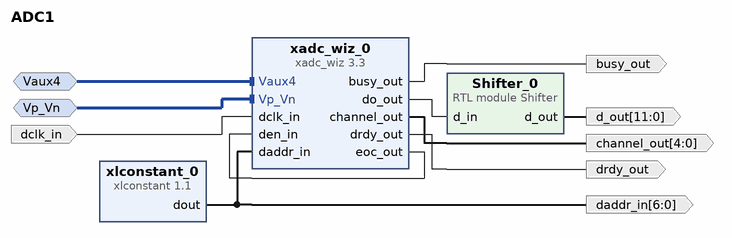
[diagram p0: block diagram of the top level]
# Vivado block design ADC1, xc7a35tcpg236-1, Vivado 2024.1.2
create_bd_design ADC1

create_bd_intf_port -mode Slave -vlnv xilinx.com:interface:diff_analog_io_rtl:1.0 Vaux4
create_bd_intf_port -mode Slave -vlnv xilinx.com:interface:diff_analog_io_rtl:1.0 Vp_Vn
create_bd_port -dir I -type clk dclk_in
set_property -dict {CONFIG.FREQ_HZ 100000000} [get_bd_ports dclk_in]
create_bd_port -dir O drdy_out
create_bd_port -dir O busy_out
create_bd_port -dir O -from 4 -to 0 channel_out
create_bd_port -dir O -from 6 -to 0 daddr_in
create_bd_port -dir O -from 11 -to 0 d_out

create_bd_cell -type ip -vlnv xilinx.com:ip:xadc_wiz:3.3 xadc_wiz_0
set_property -dict [list \
  CONFIG.ADC_CONVERSION_RATE 100 \
  CONFIG.AVERAGE_ENABLE_TEMPERATURE false \
  CONFIG.AVERAGE_ENABLE_VAUXP12_VAUXN12 false \
  CONFIG.AVERAGE_ENABLE_VAUXP4_VAUXN4 false \
  CONFIG.AVERAGE_ENABLE_VP_VN false \
  CONFIG.CHANNEL_ENABLE_TEMPERATURE false \
  CONFIG.CHANNEL_ENABLE_VAUXP12_VAUXN12 false \
  CONFIG.CHANNEL_ENABLE_VAUXP4_VAUXN4 false \
  CONFIG.CHANNEL_ENABLE_VP_VN false \
  CONFIG.DCLK_FREQUENCY 12 \
  CONFIG.ENABLE_RESET false \
  CONFIG.EXTERNAL_MUX_CHANNEL VP_VN \
  CONFIG.INTERFACE_SELECTION ENABLE_DRP \
  CONFIG.OT_ALARM false \
  CONFIG.SEQUENCER_MODE Off \
  CONFIG.SIM_FILE_NAME design2 \
  CONFIG.SIM_FILE_SEL Default \
  CONFIG.SINGLE_CHANNEL_ACQUISITION_TIME false \
  CONFIG.SINGLE_CHANNEL_SELECTION VAUXP4_VAUXN4 \
  CONFIG.TIMING_MODE Continuous \
  CONFIG.USER_TEMP_ALARM true \
  CONFIG.VCCAUX_ALARM true \
  CONFIG.VCCINT_ALARM true \
  CONFIG.WAVEFORM_TYPE CONSTANT \
  CONFIG.XADC_STARUP_SELECTION single_channel \
] [get_bd_cells xadc_wiz_0]
create_bd_cell -type ip -vlnv xilinx.com:ip:xlconstant:1.1 xlconstant_0
set_property -dict {CONFIG.CONST_VAL 20 CONFIG.CONST_WIDTH 7} [get_bd_cells xlconstant_0]
create_bd_cell -type module -reference Shifter Shifter_0

# ---- connections ----

connect_bd_intf_net -intf_net Vaux4_1 [get_bd_intf_pins xadc_wiz_0/Vaux4] [get_bd_intf_ports Vaux4]
connect_bd_intf_net [get_bd_intf_pins xadc_wiz_0/Vp_Vn] [get_bd_intf_ports Vp_Vn]
connect_bd_net [get_bd_pins Shifter_0/d_out] [get_bd_ports d_out]
connect_bd_net [get_bd_ports dclk_in] [get_bd_pins xadc_wiz_0/dclk_in]
connect_bd_net [get_bd_pins xadc_wiz_0/busy_out] [get_bd_ports busy_out]
connect_bd_net [get_bd_pins xadc_wiz_0/channel_out] [get_bd_ports channel_out]
connect_bd_net [get_bd_pins xadc_wiz_0/do_out] [get_bd_pins Shifter_0/d_in]
connect_bd_net [get_bd_pins xadc_wiz_0/drdy_out] [get_bd_ports drdy_out]
connect_bd_net [get_bd_pins xadc_wiz_0/eoc_out] [get_bd_pins xadc_wiz_0/den_in]
connect_bd_net [get_bd_pins xlconstant_0/dout] [get_bd_pins xadc_wiz_0/daddr_in] [get_bd_ports daddr_in]

validate_bd_design
save_bd_design
